# EAGLE design HTU21D Breakout (EAGLE 6.4)
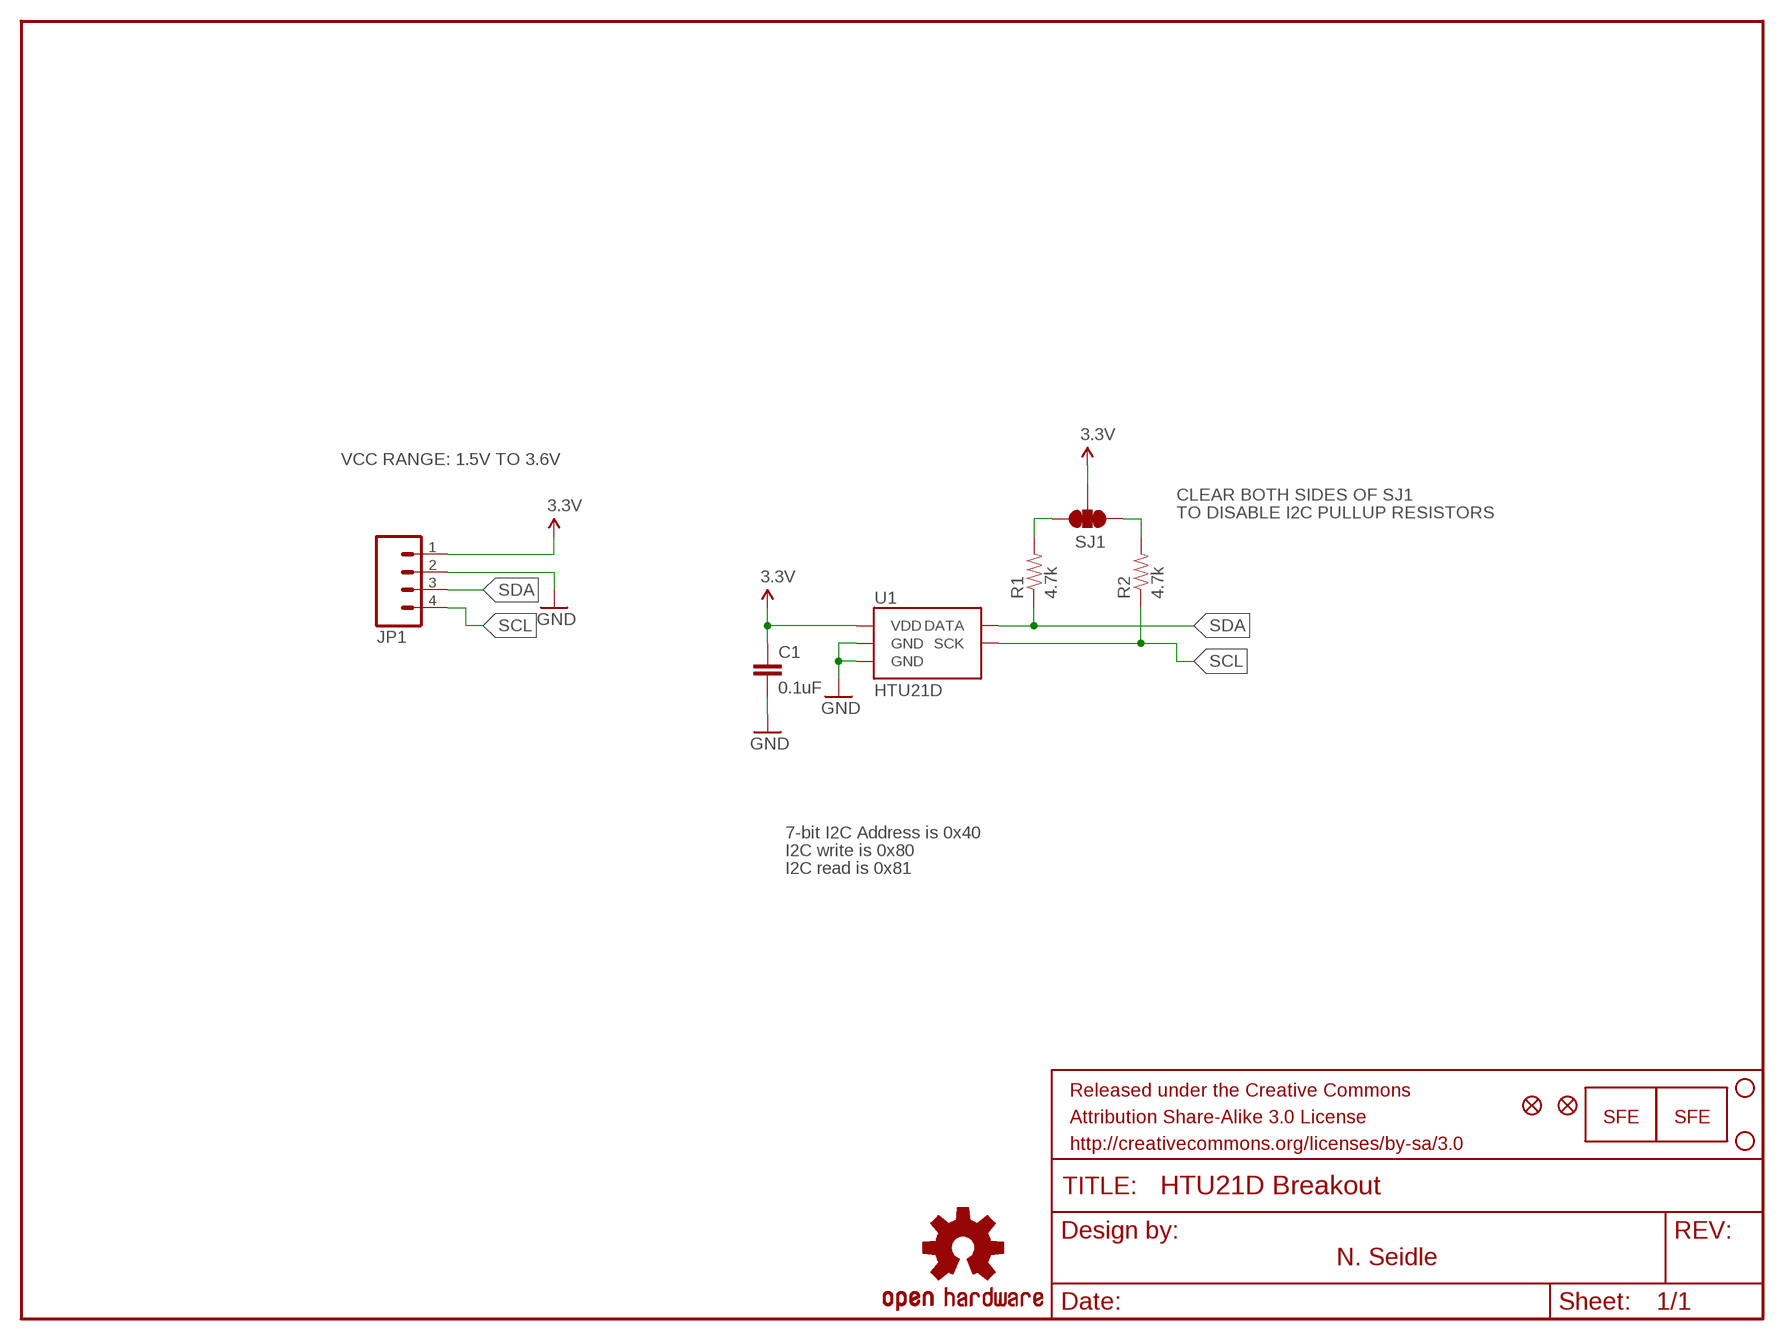
[diagram p0: schematic, sheet 1]

## Parts
C1  0.1uF  CAP0603-CAP  [0603-CAP]
FRAME2  FRAME-LETTER  [CREATIVE_COMMONS]
JP1  M04PTH  [1X04]
JP2  LOGO-SFENW2  [SFE-NEW-WEB]
JP3  FIDUCIALUFIDUCIAL  [MICRO-FIDUCIAL]
JP4  FIDUCIALUFIDUCIAL  [MICRO-FIDUCIAL]
LOGO1  LOGO-SFESK  [SFE-LOGO-FLAME]
LOGO2  OSHW-LOGOS  [OSHW-LOGO-S]
R1  4.7k  RESISTOR0603-RES  [0603-RES]
R2  4.7k  RESISTOR0603-RES  [0603-RES]
SJ1  SOLDERJUMPER_2WAYPASTE1&2&3  [SJ_3_PASTE1&2&3]
STANDOFF1  STAND-OFF  [STAND-OFF]
STANDOFF2  STAND-OFF  [STAND-OFF]
U1  HTU21D  HTU21DSMD  [HTU21D]

## Nets
3.3V: C1.1 JP1.1 SJ1.2 U1.VDD
GND: C1.2 JP1.2 U1.7(GND) U1.GND
N$1: R1.2 SJ1.3
N$2: R2.2 SJ1.1
SCL: JP1.4 R2.1 U1.SCK
SDA: JP1.3 R1.1 U1.DATA

## Notes on the sheet
- VCC RANGE: 1.5V TO 3.6V
- CLEAR BOTH SIDES OF SJ1
- TO DISABLE I2C PULLUP RESISTORS
- 7-bit I2C Address is 0x40
- I2C write is 0x80
- I2C read is 0x81
- N. Seidle

## Library data of the parts
C1 = SparkFun:CAP: Capacitor Standard 0603 ceramic capacitor, and 0.1" leaded capacitor.
FRAME2 = SparkFun-Aesthetics:FRAME-LETTER: Schematic Frame Standard 8.5x11 US Letter frame
JP1 = SparkFun-Connectors:M04: Header 4 Standard 4-pin 0.1" header. Use with straight break away headers (SKU : PRT-00116), right angle break away headers (PRT-00553), swiss pins (PRT-00743), machine pins (PRT-00117), and female headers (PRT-00115). Molex polarized connector foot print use with SKU : PRT-08231 with associated crimp pins and housings. 1MM SMD Version SKU: PRT-10208
JP2 = SparkFun-Aesthetics:LOGO-SFE: Spark Fun Electronics PCB Logo This is the standard Spark Fun Electronics PCB logo.
JP3 JP4 = SparkFun-Aesthetics:FIDUCIAL: Fiducial Alignment Points Various fiducial points for machine vision alignment.
LOGO1 = SparkFun:LOGO-SFE: Spark Fun Electronics PCB Logo This is the standard Spark Fun Electronics PCB logo.
LOGO2 = SparkFun-Aesthetics:OSHW-LOGO: Open Source Hardware Logo This logo indicates the piece of hardware it is found on incorporates a OSHW license and/or adheres to the definition of open source hardware found here: http://freedomdefined.org/OSHW
R1 R2 = SparkFun:RESISTOR: Resistor Basic schematic elements and footprints for 0603, 1206, and PTH resistors.
SJ1 = mike-temp:SOLDERJUMPER_2WAY: Solder Jumper 2 way solder jumper
STANDOFF1 STANDOFF2 = SparkFun-Electromechanical:STAND-OFF: #4 Stand Off This is the mechanical footprint for a #4 phillips button head screw. Use the keepout ring to avoid running the screw head into surrounding components. SKU : PRT-00447
U1 = SparkFun-Sensors:HTU21D

## Board
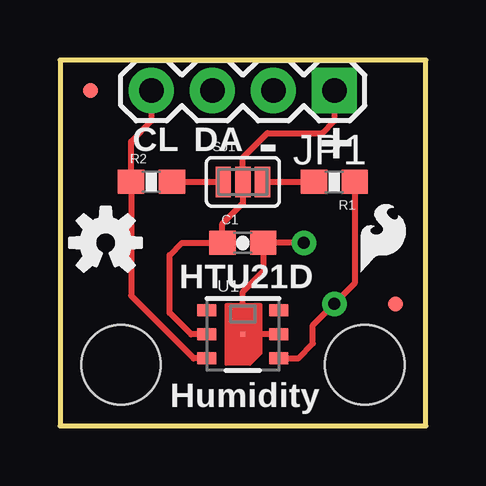
[diagram p1: board, top side]
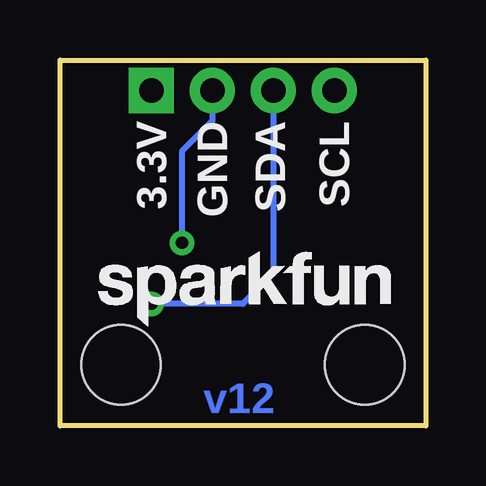
[diagram p2: board, bottom side, seen from below]

Size 15.24 x 15.24 mm. Coordinates in mm from the lower left corner, seen from the top.
Outline: 0,0 15.24,0 15.24,15.24 0,15.24 0,0
Copper layers (1*16): Top 0.035mm / dielectric 1.5mm / Bottom 0.035mm
Design rules "SparkFun": minimum track width 8mil, minimum drill 20mil, track to track 8mil, track to pad 8mil, pad to pad 8mil, via to via 8mil, smd to smd 8mil, copper to edge 10mil, drill to drill 8mil, minimum pad ring 12mil, minimum via ring 10mil, stop-mask expansion 4mil, vias tented up to drill 25mil, thermal gap 10mil

### Footprints (pad centres in the part's own frame; a part is rotated, then mirrored left to right if it is on the bottom)
0603-CAP = smd 1.1 x 1: 1 -0.85,0; 2 0.85,0
1X04 = drill 1.016 pad 1.88 square: 1 0,0 | drill 1.016 pad 1.88: 2 2.54,0; 3 5.08,0; 4 7.62,0
MICRO-FIDUCIAL = smd 0.635 x 0.635: 1 0,0
0603-RES = smd 1.1 x 1: 1 -0.85,0; 2 0.85,0
SJ_3_PASTE1&2&3 = smd 0.635 x 1.27: 1 -0.813,0; 2 0,0; 3 0.813,0
STAND-OFF = hole 3.302: 0,0
HTU21D = smd 0.2 x 0.2: 7 0,0 | smd 0.8 x 0.5: DATA 1.5,-1; GND 1.5,0; NC@1 -1.5,1; NC@6 1.5,1; SCK -1.5,-1; VDD -1.5,0

### Placement (x,y rotation side)
C1  7.62,7.62 0 top
FRAME2  -21.59,-24.13 0 top  (outside the outline)
JP1  11.43,13.97 180 top
JP2  13.65,4.13 0 bottom
JP3  1.27,13.97 0 top
JP4  13.97,5.08 0 top
LOGO1  12.54,6.41 0 top
LOGO2  1.91,7.62 0 top
R1  11.43,10.16 180 top
R2  3.81,10.16 0 top
SJ1  7.62,10.16 0 top
STANDOFF1  12.7,2.54 0 top
STANDOFF2  2.54,2.54 0 top
U1  7.62,3.81 0 top

### Tracks (layer width: path | path; a pad name or v marks a point on that pad's centre or on a via)
3.3V
  Top 0.254: JP1.1 11.43,12.7 10.92,12.19 8.64,12.19 7.62,11.18 SJ1.2 7.62,9.27 6.77,8.42 C1.1 5.08,7.62 4.57,7.11 4.57,4.7 5.46,3.81 U1.VDD
GND  (via drill 0.51)
  Top 0.254: U1.GND U1.7 7.62,5.59 8.47,6.44 C1.2 v10.16,7.62
  Bottom 0.254: v10.16,7.62 10.16,11.43 8.89,12.7 JP1.2
N$1
  Top 0.254: SJ1.3 R1.2
N$2
  Top 0.254: R2.2 SJ1.1
SCL
  Top 0.254: JP1.4 3.81,12.7 2.96,11.85 R2.1 2.96,5.42 5.57,2.81 U1.SCK
SDA  (via drill 0.51)
  Top 0.254: U1.DATA 9.92,2.81 10.54,3.43 10.54,4.19 v11.43,5.08 12.28,5.93 R1.1
  Bottom 0.254: JP1.3 6.35,6.35 7.62,5.08 v11.43,5.08

### Text on the board
Bottom: v12
tPlace: CL | DA | - | + | HTU21D | Humidity | N. Seidle
bPlace: SCL | SDA | GND | 3.3V